# EAGLE design nolleblink2012_final (EAGLE 5.09)
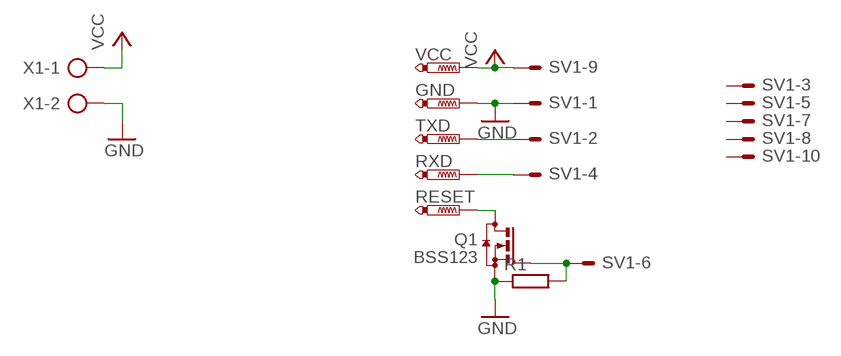
[diagram p0: schematic, sheet 1]

## Parts
GND  PTR1PAD1-13Y  [P1-13Y]
Q1  BSS123  [SOT23]
R1  R-EU_M0805  [M0805]
RESET  PTR1PAD1-13Y  [P1-13Y]
RXD  PTR1PAD1-13Y  [P1-13Y]
SV1  ML10LE  [ML10L]
TXD  PTR1PAD1-13Y  [P1-13Y]
VCC  PTR1PAD1-13Y  [P1-13Y]
X1  AK300/2  [AK300/2]

## Nets
GND: GND.TP Q1.2(S) R1.1 SV1.1 X1.2
N$1: SV1.2 TXD.TP
N$2: RXD.TP SV1.4
N$3: Q1.3(D) RESET.TP
N$4: Q1.1(G) R1.2 SV1.6
VCC: SV1.9 VCC.TP X1.1
Unconnected: SV1.3 SV1.5 SV1.7 SV1.8 SV1.10

## Library data of the parts
GND RESET RXD TXD VCC = testpad:PTR1: TEST PIN
Q1 = transistor-small-signal:BSS123: N-CHANNEL MOS FET
R1 = rcl:R-EU_: RESISTOR, European symbol
SV1 = con-harting-ml:ML10?E: HARTING
X1 = con-ptr500:AK300/2: CONNECTOR

## Board
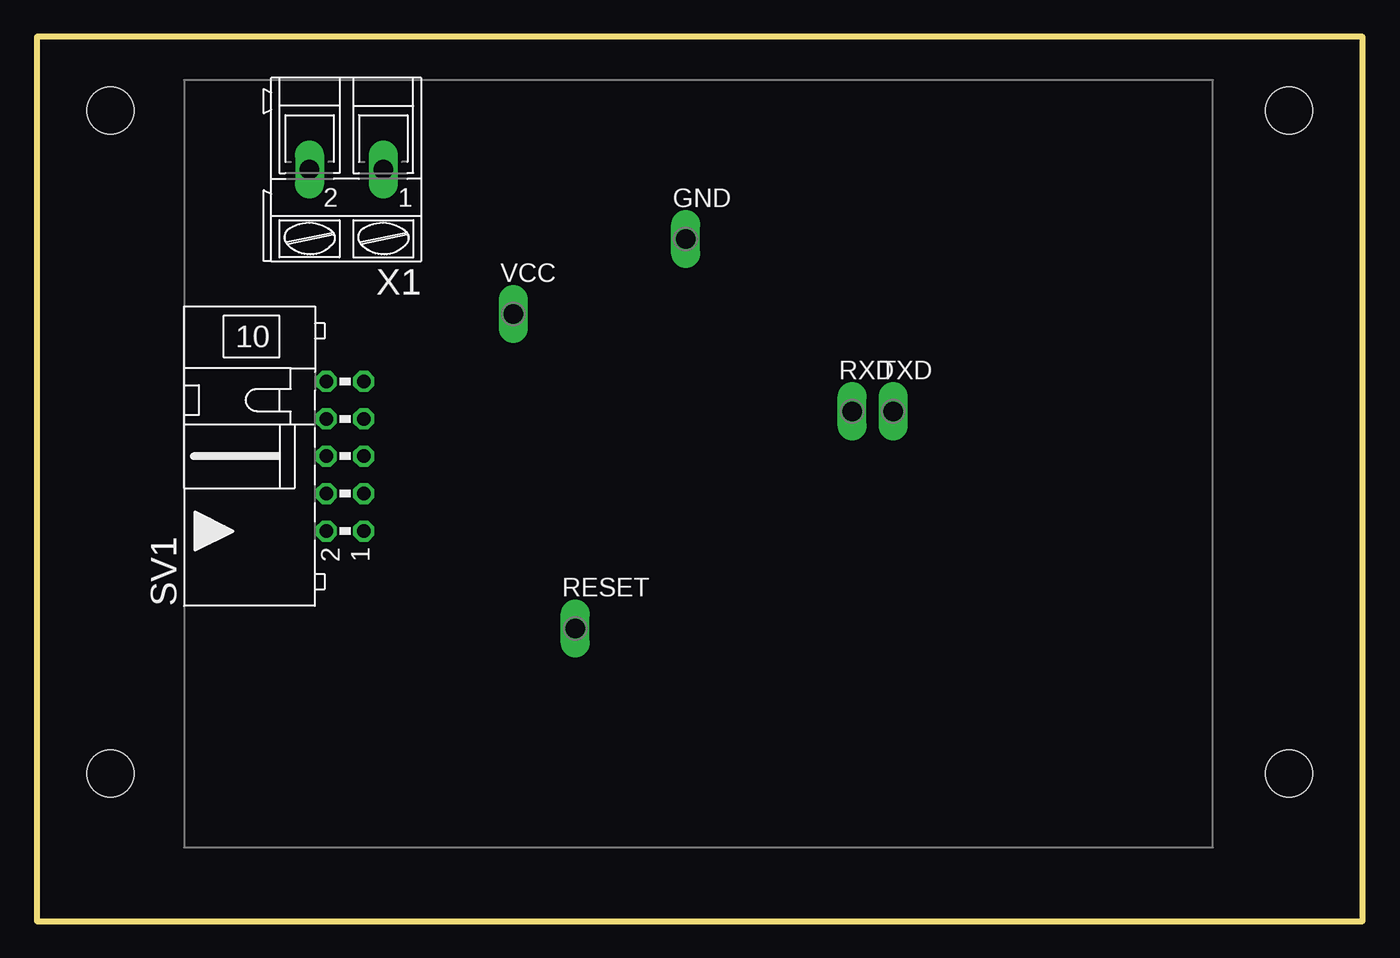
[diagram p1: board, top side]
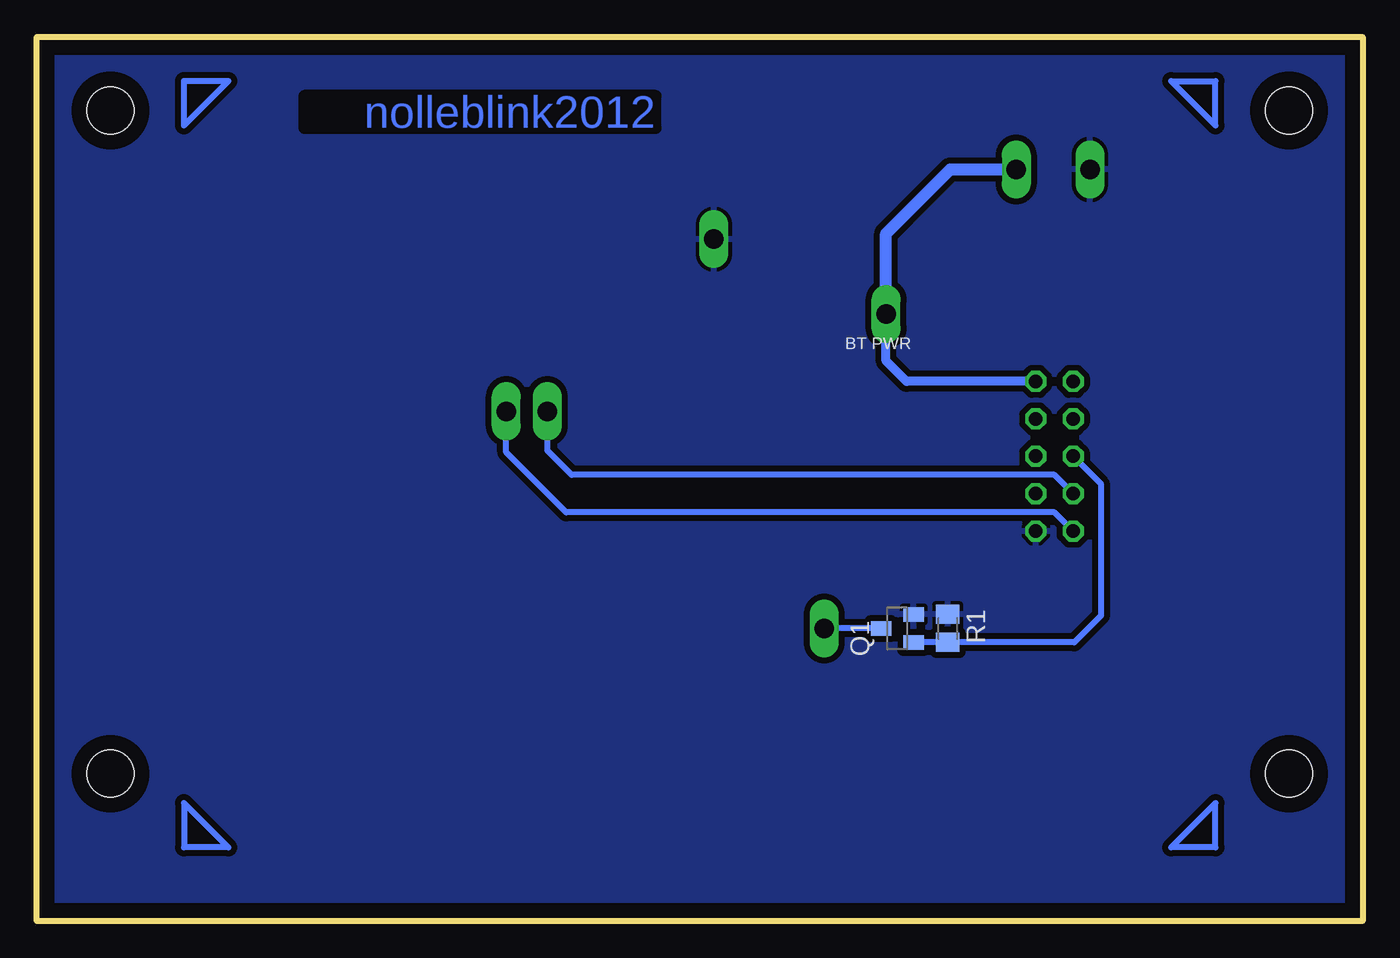
[diagram p2: board, bottom side, seen from below]

Size 90 x 60 mm. Coordinates in mm from the lower left corner, seen from the top.
Outline: 0,60 0,0 90,0 90,60 0,60
Copper layers (1*16): Top 0.035mm / dielectric 1.5mm / Bottom 0.035mm
Design rules "default": minimum track width 10mil, minimum drill 24mil, track to track 8mil, track to pad 8mil, pad to pad 8mil, via to via 8mil, smd to smd 8mil, copper to edge 40mil, drill to drill 8mil, minimum pad ring 10mil, minimum via ring 8mil, stop-mask expansion 4mil, vias tented up to drill 0mil, thermal gap 10mil
Holes 3.2 mm at 5,55 5,10 85,10 85,55

### Footprints (pad centres in the part's own frame; a part is rotated, then mirrored left to right if it is on the bottom)
P1-13Y = drill 1.321 pad 1.905 long: TP 0,0
SOT23 = smd 1 x 1.4: 1 -0.95,-1.1; 2 0.95,-1.1; 3 0,1.1
M0805 = smd 1.3 x 1.6: 1 -0.95,0; 2 0.95,0
ML10L = drill 0.914 octagon: 1 -5.08,-1.27; 2 -5.08,1.27; 3 -2.54,-1.27; 4 -2.54,1.27; 5 0,-1.27; 6 0,1.27; 7 2.54,-1.27; 8 2.54,1.27; 9 5.08,-1.27; 10 5.08,1.27
AK300/2 = drill 1.321 long: 1 -2.515,0; 2 2.489,0

### Placement (x,y rotation side)
GND  44.04,46.27 0 top
Q1  31.59,19.86 90 bottom
R1  28.16,19.86 270 bottom
RESET  36.54,19.86 0 top
RXD  55.34,34.59 0 top
SV1  20.92,31.54 90 top
TXD  58.13,34.59 0 top
VCC  32.35,41.2 0 top
X1  21,51 180 top

### Tracks (layer width: path | path; a pad name or v marks a point on that pad's centre or on a via)
GND
  pour Bottom (isolate 0.406): -0.13,0 89.98,0 89.98,60.2 -0.13,60.2
N$1
  Bottom 0.406: SV1.2 20.92,27.73 54.07,27.73 58.13,31.8 TXD.TP
N$2
  Bottom 0.406: SV1.4 20.92,30.27 53.69,30.27 55.34,31.92 RXD.TP
N$3
  Bottom 0.406: Q1.3 RESET.TP
N$4
  Bottom 0.406: Q1.1 R1.2 19.59,18.91 17.75,20.75 17.75,29.64 SV1.6
N$5
  Bottom 0.406: 13,57 10,57 10,54 13,57
N$6
  Bottom 0.406: 10,5 10,8 13,5 10,5
N$7
  Bottom 0.406: 80,8 80,5 77,5 80,8
N$8
  Bottom 0.406: 80,54 80,57 77,57 80,54
VCC
  Bottom 0.61: SV1.9 30.95,36.62 32.35,38.02 VCC.TP
  Bottom 0.813: X1.1 28,51 32.35,46.65 VCC.TP

### Text on the board
Bottom: nolleblink2012
bNames: BT PWR
Document: FEL. TVÄRTOM ---> | --> | Halv millimeter för mycket?